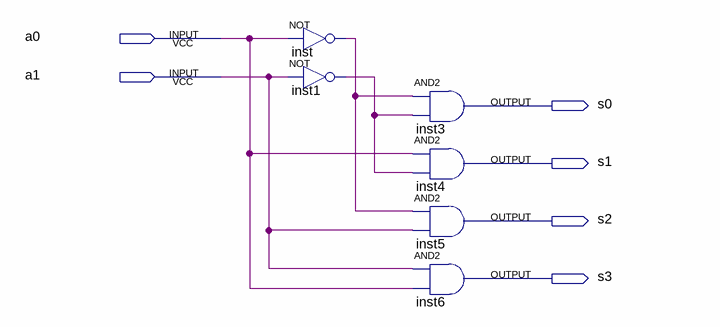
[diagram p0: schematic sheet]
// Quartus schematic decod2x4.bdf as structural Verilog: 6 symbols, 6 pins
module decod2x4 (
  input  a0,
  input  a1,
  output s0,
  output s1,
  output s2,
  output s3
);

  wire inst1_out, inst_out;

  not inst (inst_out, a0);
  not inst1 (inst1_out, a1);
  and inst3 (s0, inst_out, inst1_out);
  and inst4 (s1, a0, inst1_out);
  and inst5 (s2, inst_out, a1);
  and inst6 (s3, a1, a0);
endmodule
